# EAGLE design BPMLabColumnRX (EAGLE 7.5.0)
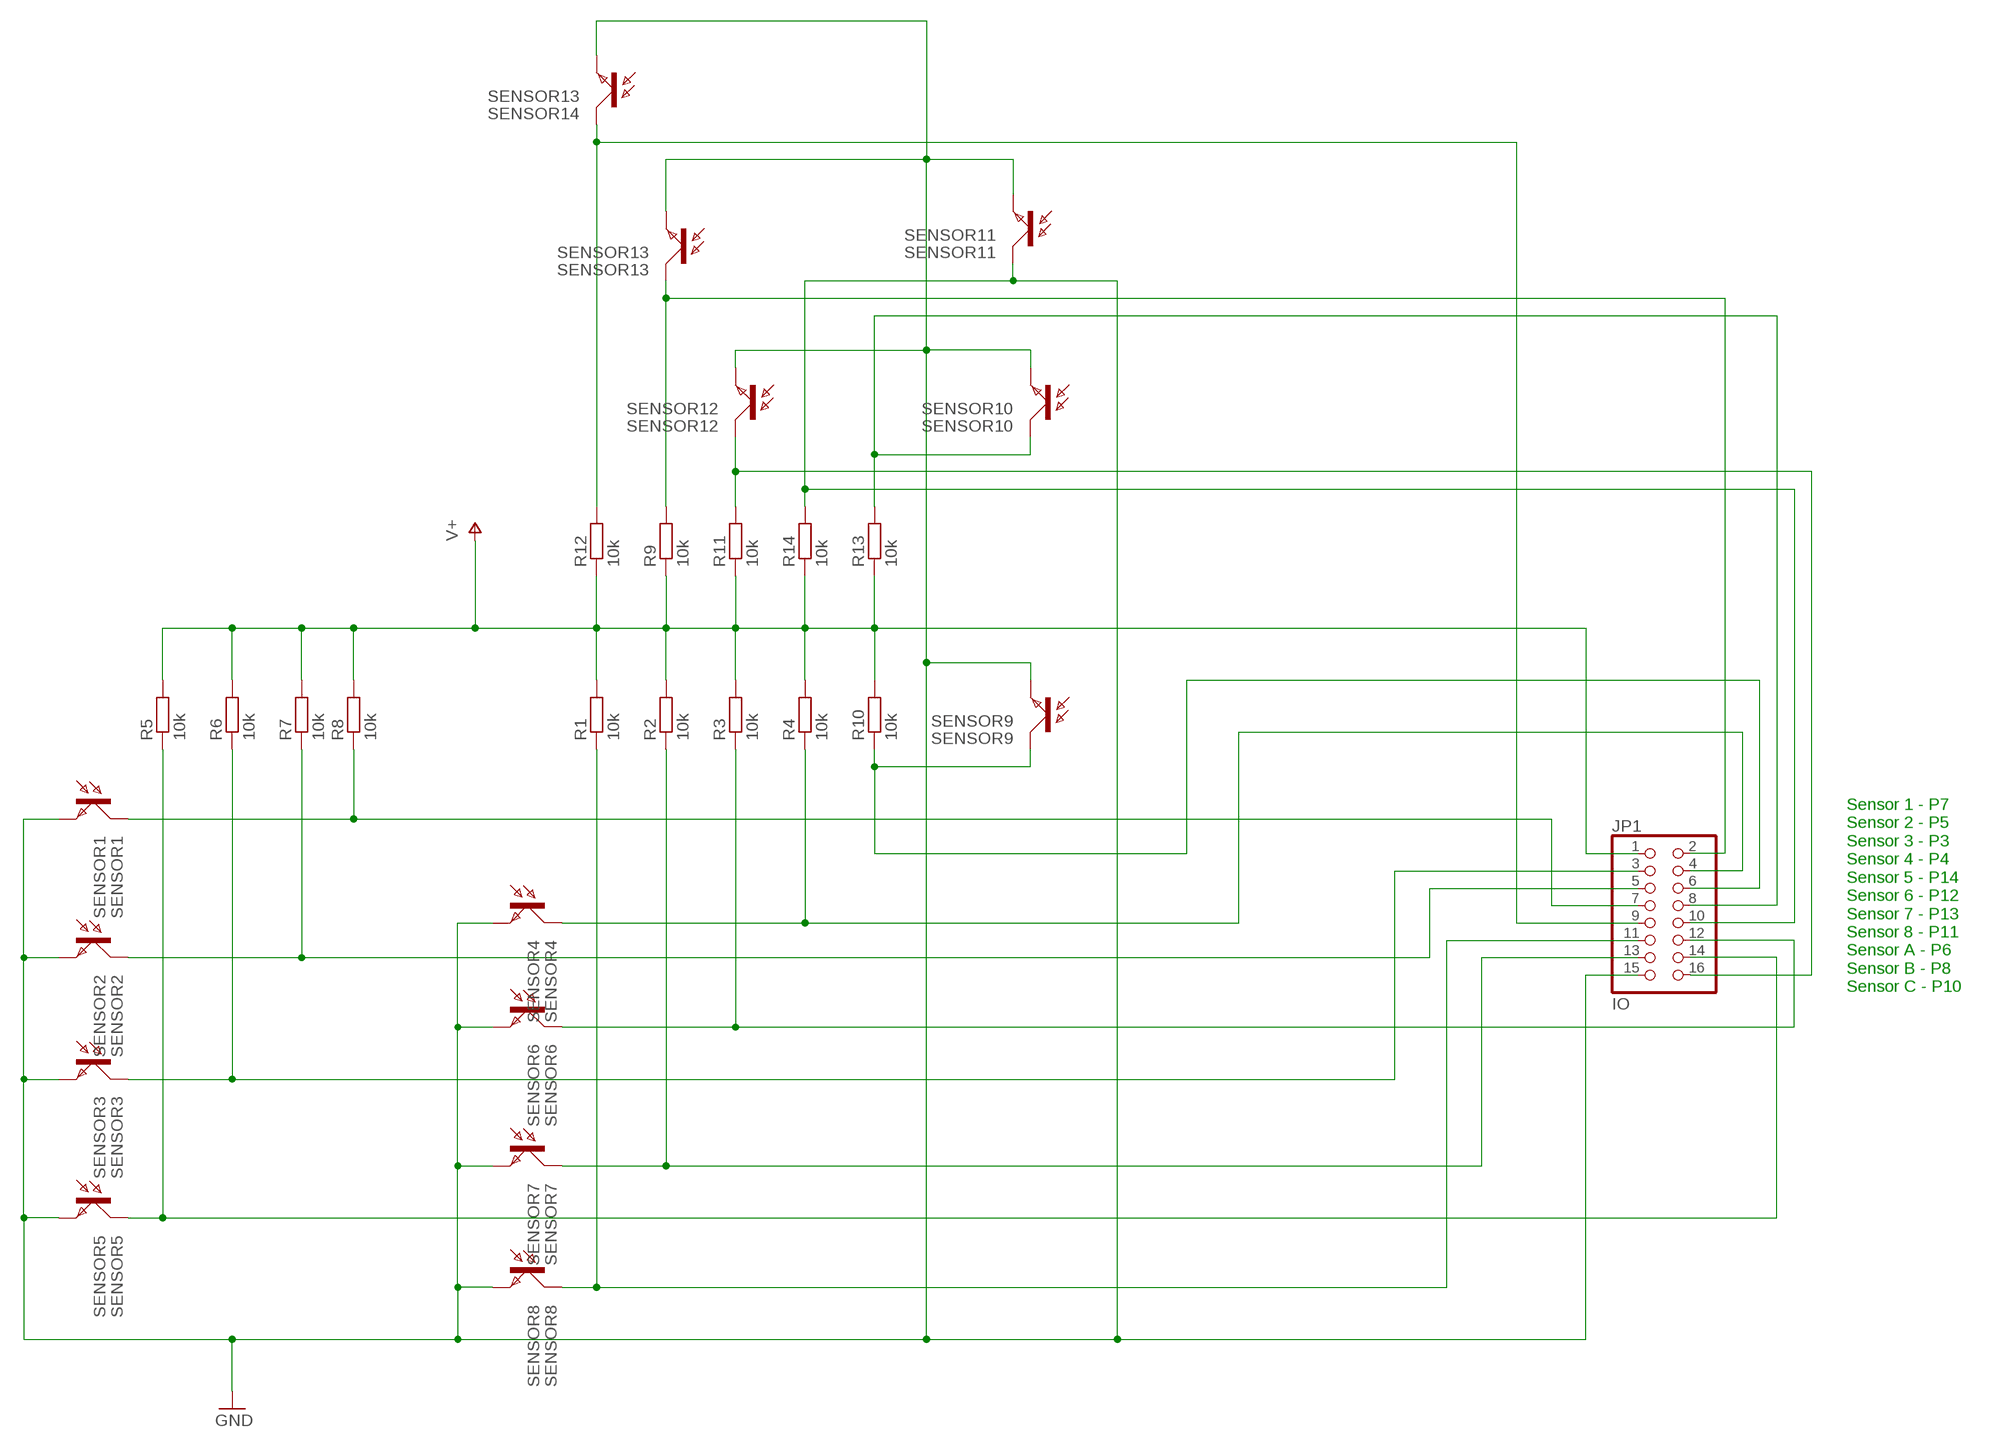
[diagram p0: schematic, sheet 1]

## Parts
JP1  IO  PINHD-2X8  [2X08]
R1  10k  R-EU_M0805  [M0805]
R2  10k  R-EU_M0805  [M0805]
R3  10k  R-EU_M0805  [M0805]
R4  10k  R-EU_M0805  [M0805]
R5  10k  R-EU_M0805  [M0805]
R6  10k  R-EU_M0805  [M0805]
R7  10k  R-EU_M0805  [M0805]
R8  10k  R-EU_M0805  [M0805]
R9  10k  R-EU_M0805  [M0805]
R10  10k  R-EU_M0805  [M0805]
R11  10k  R-EU_M0805  [M0805]
R12  10k  R-EU_M0805  [M0805]
R13  10k  R-EU_M0805  [M0805]
R14  10k  R-EU_M0805  [M0805]
SENSOR1  SENSOR1  BPX81  [BPX81]
SENSOR2  SENSOR2  BPX81  [BPX81]
SENSOR3  SENSOR3  BPX81  [BPX81]
SENSOR4  SENSOR4  BPX81  [BPX81]
SENSOR5  SENSOR5  BPX81  [BPX81]
SENSOR6  SENSOR6  BPX81  [BPX81]
SENSOR7  SENSOR7  BPX81  [BPX81]
SENSOR8  SENSOR8  BPX81  [BPX81]
SENSOR9  SENSOR9  BPX81  [BPX81]
SENSOR10  SENSOR10  BPX81  [BPX81]
SENSOR11  SENSOR11  BPX81  [BPX81]
SENSOR12  SENSOR12  BPX81  [BPX81]
SENSOR13  SENSOR13  BPX81  [BPX81]
SENSOR14  SENSOR13  BPX81  [BPX81]

## Nets
GND: JP1.10 JP1.15 R14.2 SENSOR1.E SENSOR2.E SENSOR3.E SENSOR4.E SENSOR5.E SENSOR6.E SENSOR7.E SENSOR8.E SENSOR9.E SENSOR10.E SENSOR11.C SENSOR11.E SENSOR12.E SENSOR13.E SENSOR14.E
N$1: JP1.4 R4.1 SENSOR4.C
N$2: JP1.12 R3.1 SENSOR6.C
N$3: JP1.13 R2.1 SENSOR7.C
N$4: JP1.11 R1.1 SENSOR8.C
N$5: JP1.7 R8.1 SENSOR1.C
N$6: JP1.5 R7.1 SENSOR2.C
N$7: JP1.3 R6.1 SENSOR3.C
N$8: JP1.14 R5.1 SENSOR5.C
N$9: JP1.6 R10.1 SENSOR9.C
N$10: JP1.2 R9.2 SENSOR13.C
N$11: JP1.16 R11.2 SENSOR12.C
N$12: JP1.9 R12.2 SENSOR14.C
N$16: JP1.8 R13.2 SENSOR10.C
V+: JP1.1 R1.2 R2.2 R3.2 R4.2 R5.2 R6.2 R7.2 R8.2 R9.1 R10.2 R11.1 R12.1 R13.1 R14.1

## Notes on the sheet
- Sensor 1 - P7
  Sensor 2 - P5
  Sensor 3 - P3
  Sensor 4 - P4
  Sensor 5 - P14
  Sensor 6 - P12
  Sensor 7 - P13
  Sensor 8 - P11
  Sensor A - P6
  Sensor B - P8
  Sensor C - P10

## Library data of the parts
JP1 = pinhead:PINHD-2X8: PIN HEADER
R1-R14 = resistor:R-EU_: RESISTOR, European symbol
SENSOR1-SENSOR14 = opto-trans-siemens:BPX81: PHOTO TRANSISTOR; OC_FARNELL: unknown; OC_NEWARK: unknown

## Board
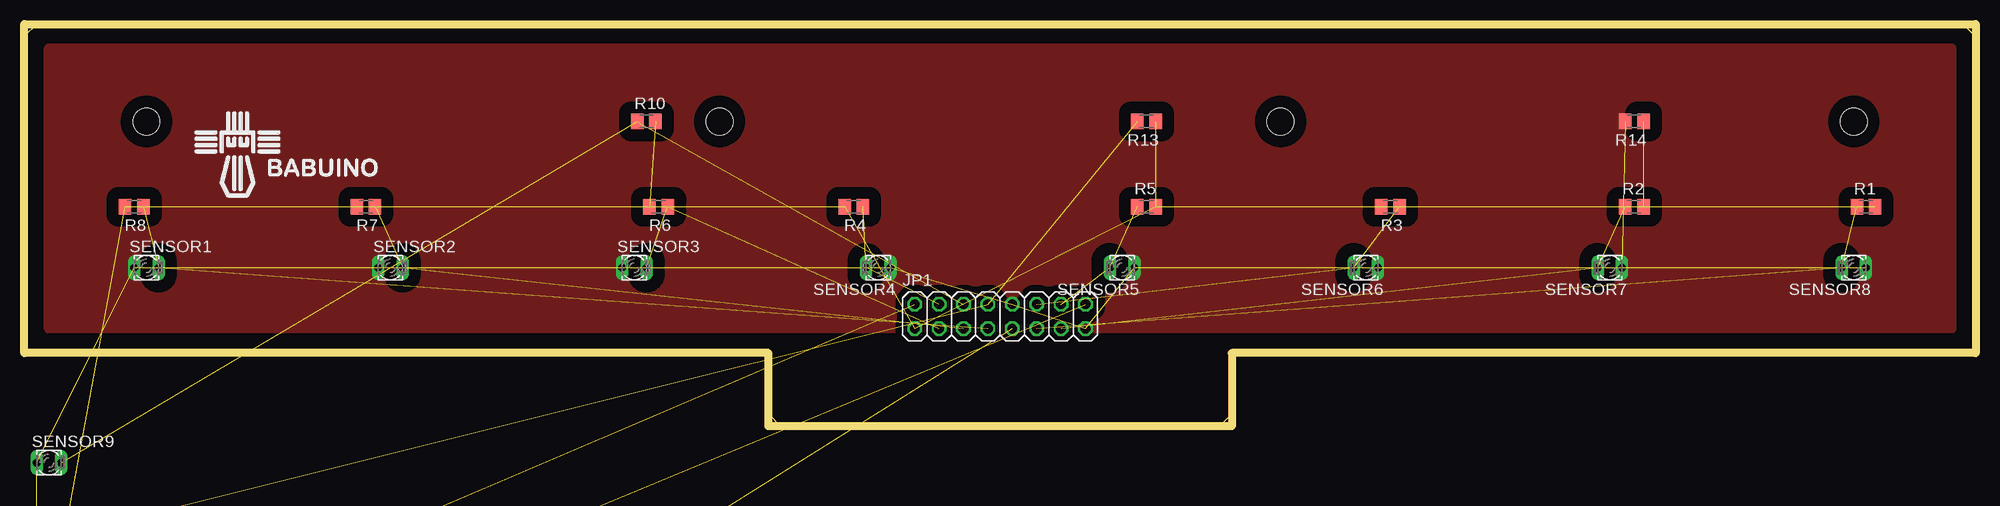
[diagram p1: board, top side]

Size 203.18 x 41.91 mm. Coordinates in mm from the lower left corner, seen from the top.
Outline: 0,7.62 77.47,7.62 77.47,1.27 78.74,0 124.46,0 125.73,1.27 125.73,7.62 203.18,7.62 203.18,40.66 201.93,41.91 1.27,41.91 0,40.64 0,7.62
Copper layers (1*16): Top 0.035mm / dielectric 1.5mm / Bottom 0.035mm
Design rules "default *": minimum track width 40mil, minimum drill 30mil, track to track 8mil, track to pad 8mil, pad to pad 8mil, via to via 8mil, smd to smd 8mil, copper to edge 40mil, drill to drill 8mil, minimum pad ring 10mil, minimum via ring 8mil, stop-mask expansion 4mil, vias tented up to drill 0mil, thermal gap 0mil
Holes 2.8 mm at 72.39,31.75 130.81,31.75 190.5,31.75 12.7,31.75
Milling: 8 lines

### Footprints (pad centres in the part's own frame; a part is rotated, then mirrored left to right if it is on the bottom)
2X08 = drill 1.016 octagon: 1 -8.89,-1.27; 2 -8.89,1.27; 3 -6.35,-1.27; 4 -6.35,1.27; 5 -3.81,-1.27; 6 -3.81,1.27; 7 -1.27,-1.27; 8 -1.27,1.27; 9 1.27,-1.27; 10 1.27,1.27; 11 3.81,-1.27; 12 3.81,1.27; 13 6.35,-1.27; 14 6.35,1.27; 15 8.89,-1.27; 16 8.89,1.27
M0805 = smd 1.3 x 1.6: 1 -0.95,0; 2 0.95,0
BPX81 = drill 0.813 long: C 1.27,0; E -1.27,0

### Placement (x,y rotation side)
JP1  101.6,11.43 0 top
R1  191.77,22.86 0 top
R2  167.64,22.86 0 top
R3  142.24,22.86 180 top
R4  86.36,22.86 180 top
R5  116.84,22.86 0 top
R6  66.04,22.86 180 top
R7  35.56,22.86 180 top
R8  11.43,22.86 180 top
R9  2.54,-25.4 0 top  (outside the outline)
R10  64.77,31.75 0 top
R11  2.54,-31.75 0 top  (outside the outline)
R12  2.54,-52.07 0 top  (outside the outline)
R13  116.84,31.75 180 top
R14  167.64,31.75 180 top
SENSOR1  12.7,16.51 0 top
SENSOR2  38.1,16.51 0 top
SENSOR3  63.5,16.51 0 top
SENSOR4  88.9,16.51 180 top
SENSOR5  114.3,16.51 180 top
SENSOR6  139.7,16.51 180 top
SENSOR7  165.1,16.51 180 top
SENSOR8  190.5,16.51 180 top
SENSOR9  2.54,-3.81 0 top  (outside the outline)
SENSOR10  2.54,-11.43 0 top  (outside the outline)
SENSOR11  2.54,-19.05 0 top  (outside the outline)
SENSOR12  2.54,-38.1 0 top  (outside the outline)
SENSOR13  2.54,-45.72 0 top  (outside the outline)
SENSOR14  2.54,-58.42 0 top  (outside the outline)

### Tracks (layer width: path | path; a pad name or v marks a point on that pad's centre or on a via)
GND  (17 unrouted)
  pour Top (isolate 1.27): 2.54,39.37 200.66,39.37 200.66,10.16 2.54,10.16
N$1  (2 unrouted)
N$2  (2 unrouted)
N$3  (2 unrouted)
N$4  (2 unrouted)
N$5  (2 unrouted)
N$6  (2 unrouted)
N$7  (2 unrouted)
N$8  (2 unrouted)
N$9  (2 unrouted)
N$10  (2 unrouted)
N$11  (2 unrouted)
N$12  (2 unrouted)
N$16  (2 unrouted)
V+  (14 unrouted)